# Altium schematic sheet VideoArcade.SCHDOC: LiveDesign Evaluation - Video Games
size A3; Organization: Altium Limited; Address1: L3, 12a Rodborough Rd; Address2: Frenchs Forest; Address3: NSW; Address4: Australia 2086; DocumentNumber: 1; SheetNumber: 1; SheetTotal: 13
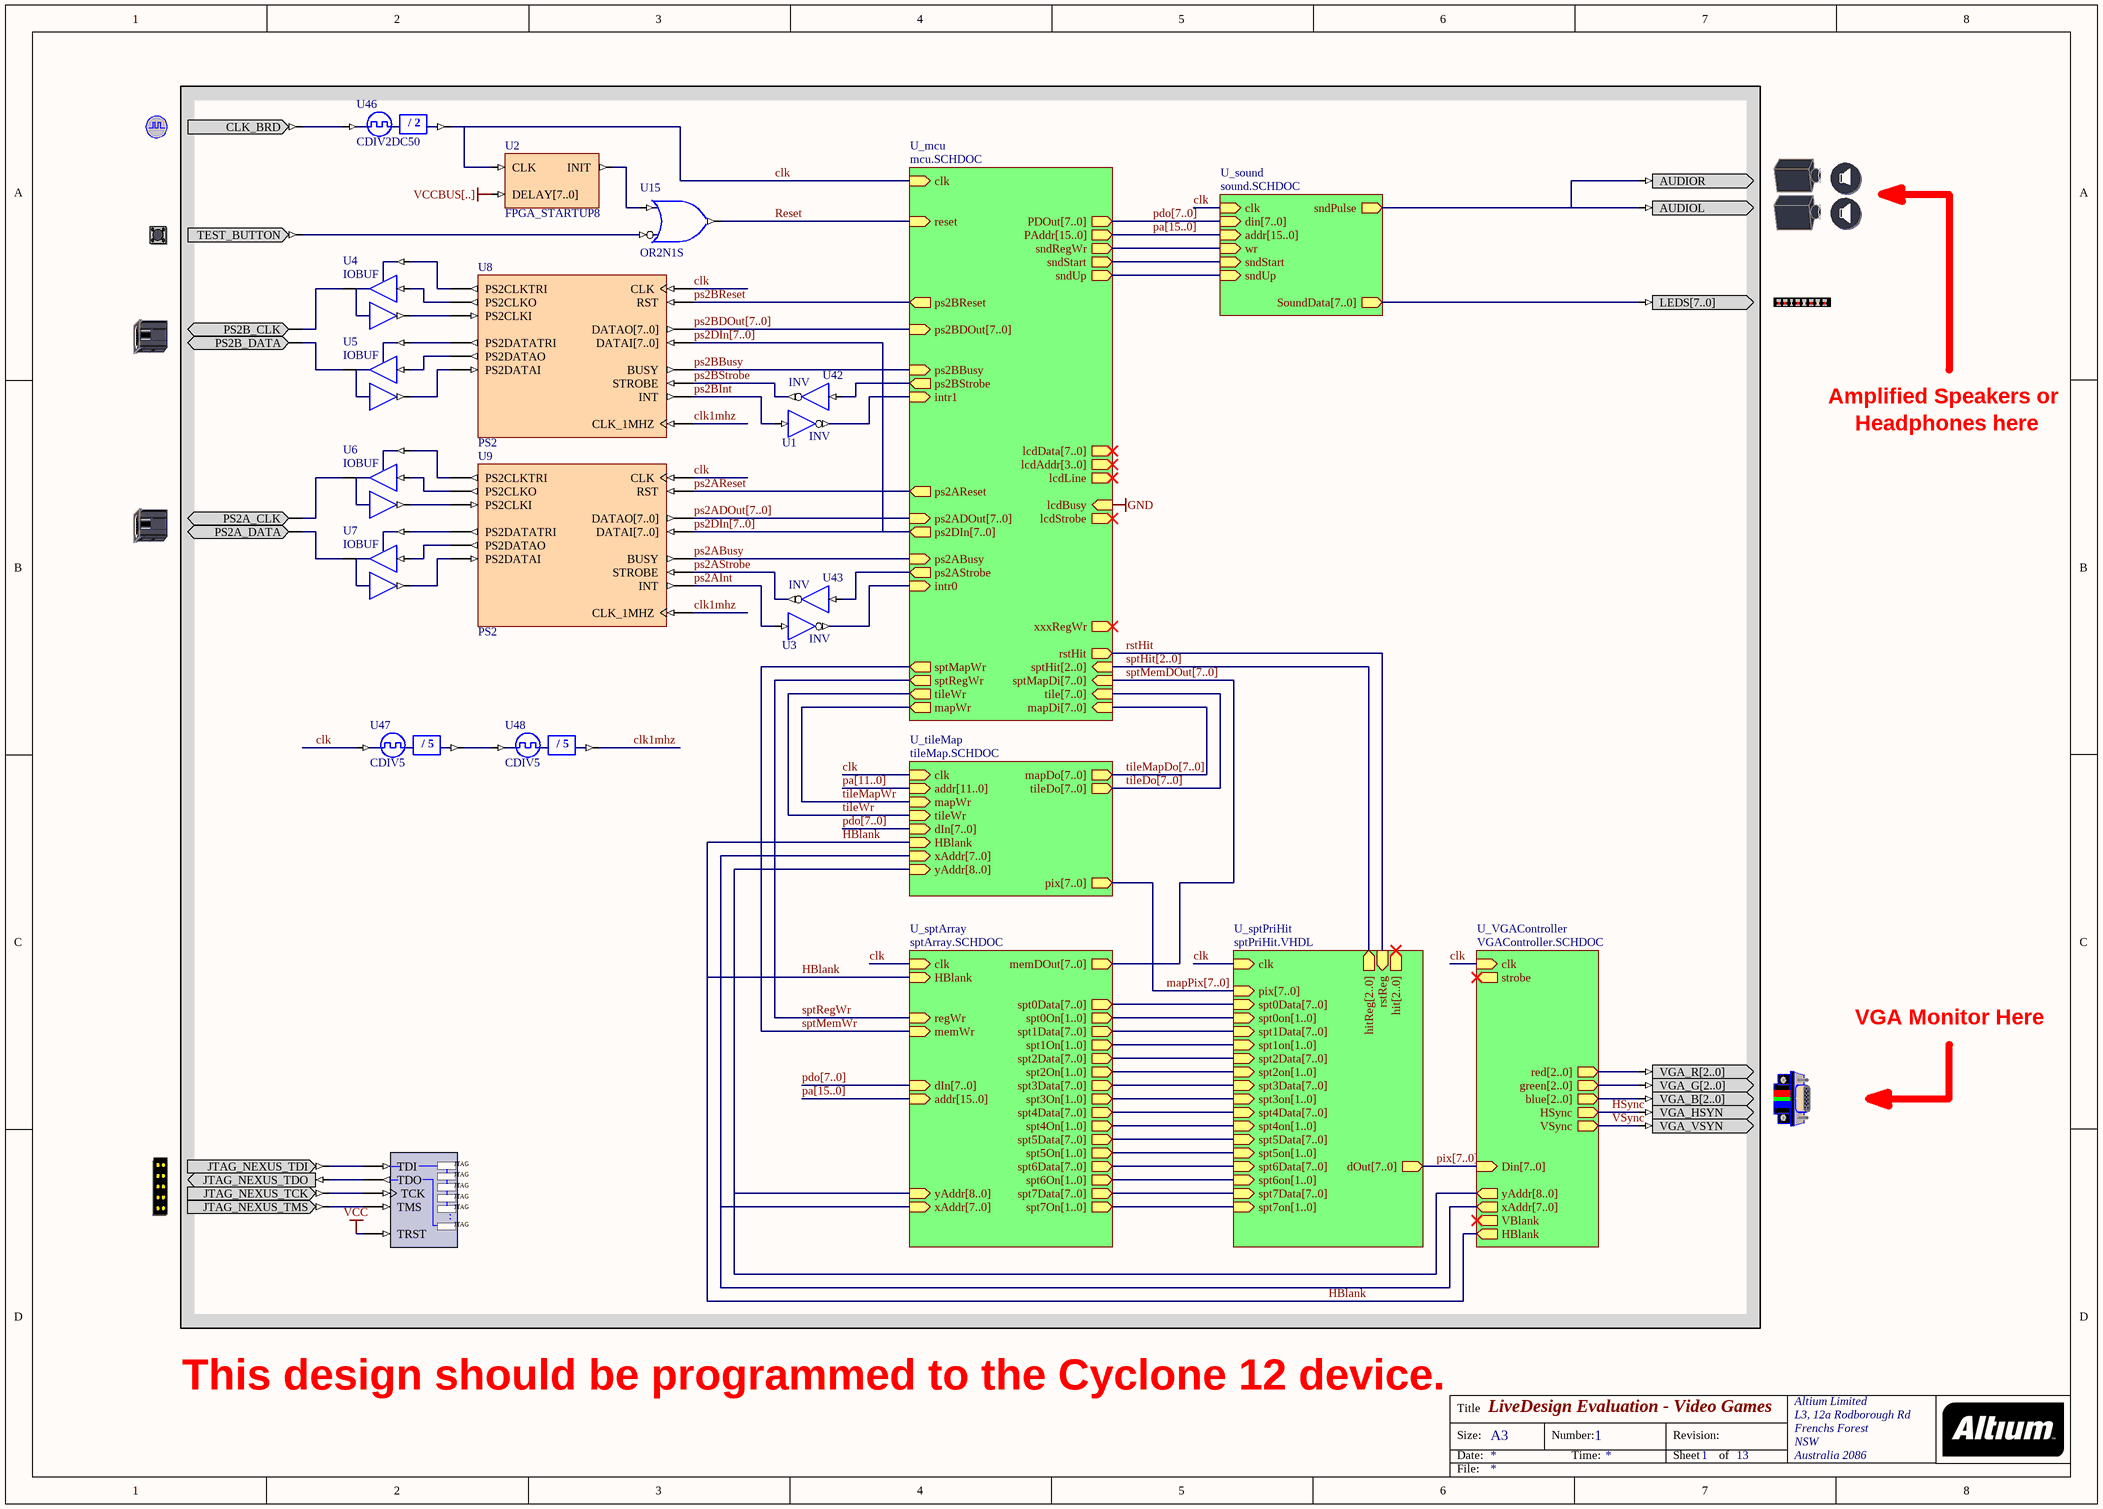
[diagram p0: VideoArcade.SCHDOC]

## Parts
?  LED  (value not drawn)
CLOCK_BOARD  CLOCK_BOARD  (value not drawn)
NEXUS_JTAG_CONNECTOR  NEXUS_JTAG_CONNECTOR  (value not drawn)
NEXUS_JTAG_PORT  NEXUS_JTAG_PORT  (value not drawn)
PS2A  PS2A  (value not drawn)
PS2B  PS2B  (value not drawn)
STEREO  STEREO  (value not drawn)
TEST_BUTTON  TEST_BUTTON  (value not drawn)
U1  INV
U2  FPGA_STARTUP8
U3  INV
U4  IOBUF
U5  IOBUF
U6  IOBUF
U7  IOBUF
U8  PS2
U9  PS2
U15  OR2N1S
U42  INV
U43  INV
U46  CDIV2DC50
U47  CDIV5
U48  CDIV5
VGACNTR  VGACNTR  (value not drawn)

## Sub-sheets
U_mcu = mcu.SCHDOC: reset (in), clk (in), intr0 (in), intr1 (in), sptMapDi[7..0] (in), mapDi[7..0] (in), tile[7..0] (in), sptMapWr (out), mapWr (out), tileWr (out), rstHit (out), lcdData[7..0] (out), sptHit[2..0] (in), ps2DIn[7..0] (out), ps2ADOut[7..0] (in), lcdAddr[3..0] (out), ps2BDOut[7..0] (in), PAddr[15..0] (out), PDOut[7..0] (out), sptRegWr (out), sndRegWr (out), xxxRegWr (out), ps2BStrobe (out), sndUp (out), ps2AStrobe (out), ps2AReset (out), sndStart (out), ps2BReset (out), lcdBusy (in), ps2ABusy (in), ps2BBusy (in), lcdStrobe (out), lcdLine (out)
U_sound = sound.SCHDOC: wr (in), addr[15..0] (in), din[7..0] (in), clk (in), sndStart (in), sndPulse (out), sndUp (in), SoundData[7..0] (out)
U_sptArray = sptArray.SCHDOC: HBlank (in), yAddr[8..0] (in), xAddr[7..0] (in), spt0Data[7..0] (out), spt0On[1..0] (out), spt1Data[7..0] (out), spt1On[1..0] (out), spt2Data[7..0] (out), spt2On[1..0] (out), spt3Data[7..0] (out), spt3On[1..0] (out), spt4Data[7..0] (out), spt4On[1..0] (out), spt5Data[7..0] (out), spt5On[1..0] (out), spt6Data[7..0] (out), spt6On[1..0] (out), spt7Data[7..0] (out), spt7On[1..0] (out), clk (in), dIn[7..0] (in), regWr (in), addr[15..0] (in), memWr (in), memDOut[7..0] (out)
U_sptPriHit = sptPriHit.VHDL: clk (in), dOut[7..0] (out), hit[2..0] (out), hitReg[2..0] (out), pix[7..0] (in), rstReg (in), spt0Data[7..0] (in), spt0on[1..0] (in), spt1Data[7..0] (in), spt1on[1..0] (in), spt2Data[7..0] (in), spt2on[1..0] (in), spt3Data[7..0] (in), spt3on[1..0] (in), spt4Data[7..0] (in), spt4on[1..0] (in), spt5Data[7..0] (in), spt5on[1..0] (in), spt6Data[7..0] (in), spt6on[1..0] (in), spt7Data[7..0] (in), spt7on[1..0] (in)  | VHDLENTITY: sptPriHit
U_tileMap = tileMap.SCHDOC: clk (in), addr[11..0] (in), mapWr (in), tileWr (in), dIn[7..0] (in), HBlank (in), pix[7..0] (out), xAddr[7..0] (in), yAddr[8..0] (in), tileDo[7..0] (out), mapDo[7..0] (out)
U_VGAController = VGAController.SCHDOC: green[2..0] (out), red[2..0] (out), blue[2..0] (out), HSync (out), VSync (out), clk (in), strobe (out), Din[7..0] (in), xAddr[7..0] (out), yAddr[8..0] (out), VBlank (out), HBlank (out)

## Nets
GND: sheet U_mcu/lcdBusy
VCC: NEXUS_JTAG_PORT.TRST
VCCBUS[..]: U2.DELAY[7..0]
clk: U2.CLK U8.CLK U9.CLK U46.CLKDV U47.CLKIN ; sheet U_sptArray/clk, sheet U_sptPriHit/clk, sheet U_VGAController/clk, sheet U_tileMap/clk, sheet U_mcu/clk, sheet U_sound/clk
clk1mhz: U8.CLK_1MHZ U9.CLK_1MHZ U48.CLKDV
HBlank: sheet U_sptArray/HBlank, sheet U_VGAController/HBlank, sheet U_tileMap/HBlank
HSync: VGACNTR.VGA_HSYN ; sheet U_VGAController/HSync
ps2ABusy: U9.BUSY ; sheet U_mcu/ps2ABusy
ps2ADOut[7..0]: U9.DATAO[7..0] ; sheet U_mcu/ps2ADOut[7..0]
ps2AInt: U3.I U9.INT
ps2AReset: U9.RST ; sheet U_mcu/ps2AReset
ps2AStrobe: U9.STROBE U43.O
ps2BBusy: U8.BUSY ; sheet U_mcu/ps2BBusy
ps2BDOut[7..0]: U8.DATAO[7..0] ; sheet U_mcu/ps2BDOut[7..0]
ps2BInt: U1.I U8.INT
ps2BReset: U8.RST ; sheet U_mcu/ps2BReset
ps2BStrobe: U8.STROBE U42.O
ps2DIn[7..0]: U8.DATAI[7..0] U9.DATAI[7..0] ; sheet U_mcu/ps2DIn[7..0]
Reset: U15.O ; sheet U_mcu/reset
rstHit: sheet U_sptPriHit/rstReg, sheet U_mcu/rstHit
sptMemWr: sheet U_sptArray/memWr, sheet U_mcu/sptMapWr
sptRegWr: sheet U_sptArray/regWr, sheet U_mcu/sptRegWr
tileMapWr: sheet U_tileMap/mapWr, sheet U_mcu/mapWr
tileWr: sheet U_tileMap/tileWr, sheet U_mcu/tileWr
VSync: VGACNTR.VGA_VSYN ; sheet U_VGAController/VSync
Net?_LEDS[7..0]: ?.LEDS[7..0] ; sheet U_sound/SoundData[7..0]
NetCLOCK_BOARD_CLK_BRD: CLOCK_BOARD.CLK_BRD U46.CLKIN
NetNEXUS_JTAG_CONNECTOR_JTAG_NEXUS_TCK: NEXUS_JTAG_CONNECTOR.JTAG_NEXUS_TCK NEXUS_JTAG_PORT.TCK
NetNEXUS_JTAG_CONNECTOR_JTAG_NEXUS_TDI: NEXUS_JTAG_CONNECTOR.JTAG_NEXUS_TDI NEXUS_JTAG_PORT.TDI
NetNEXUS_JTAG_CONNECTOR_JTAG_NEXUS_TDO: NEXUS_JTAG_CONNECTOR.JTAG_NEXUS_TDO NEXUS_JTAG_PORT.TDO
NetNEXUS_JTAG_CONNECTOR_JTAG_NEXUS_TMS: NEXUS_JTAG_CONNECTOR.JTAG_NEXUS_TMS NEXUS_JTAG_PORT.TMS
NetPS2A_PS2A_CLK: PS2A.PS2A_CLK U6.IO
NetPS2A_PS2A_DATA: PS2A.PS2A_DATA U7.IO
NetPS2B_PS2B_CLK: PS2B.PS2B_CLK U4.IO
NetPS2B_PS2B_DATA: PS2B.PS2B_DATA U5.IO
NetSTEREO_AUDIOL: STEREO.AUDIOL STEREO.AUDIOR ; sheet U_sound/sndPulse
NetTEST_BUTTON_TEST_BUTTON: TEST_BUTTON.TEST_BUTTON U15.I0
NetU1_O: U1.O ; sheet U_mcu/intr1
NetU2_INIT: U2.INIT U15.I1
NetU3_O: U3.O ; sheet U_mcu/intr0
NetU4_I: U4.I U8.PS2CLKO
NetU4_O: U4.O U8.PS2CLKI
NetU4_T: U4.T U8.PS2CLKTRI
NetU5_I: U5.I U8.PS2DATAO
NetU5_O: U5.O U8.PS2DATAI
NetU5_T: U5.T U8.PS2DATATRI
NetU6_I: U6.I U9.PS2CLKO
NetU6_O: U6.O U9.PS2CLKI
NetU6_T: U6.T U9.PS2CLKTRI
NetU7_I: U7.I U9.PS2DATAO
NetU7_O: U7.O U9.PS2DATAI
NetU7_T: U7.T U9.PS2DATATRI
NetU42_I: U42.I ; sheet U_mcu/ps2BStrobe
NetU43_I: U43.I ; sheet U_mcu/ps2AStrobe
NetU47_CLKDV: U47.CLKDV U48.CLKIN
NetVGACNTR_VGA_B[2..0]: VGACNTR.VGA_B[2..0] ; sheet U_VGAController/blue[2..0]
NetVGACNTR_VGA_G[2..0]: VGACNTR.VGA_G[2..0] ; sheet U_VGAController/green[2..0]
NetVGACNTR_VGA_R[2..0]: VGACNTR.VGA_R[2..0] ; sheet U_VGAController/red[2..0]
(unnamed): sheet U_mcu/sndRegWr, sheet U_sound/wr
(unnamed): sheet U_mcu/sndUp, sheet U_sound/sndUp
(unnamed): sheet U_mcu/sndStart, sheet U_sound/sndStart

## Buses and harness runs
bus mapPix[7..0] = sheet U_sptPriHit/pix[7..0] = sheet U_tileMap/pix[7..0]
bus pa[11..0] = sheet U_tileMap/addr[11..0]
bus pa[15..0] = sheet U_mcu/PAddr[15..0] = sheet U_sound/addr[15..0]
bus pa[15..0] = sheet U_sptArray/addr[15..0]
bus pdo[7..0] = sheet U_mcu/PDOut[7..0] = sheet U_sound/din[7..0]
bus pdo[7..0] = sheet U_sptArray/dIn[7..0]
bus pdo[7..0] = sheet U_tileMap/dIn[7..0]
bus pix[7..0] = sheet U_sptPriHit/dOut[7..0] = sheet U_VGAController/Din[7..0]
bus ps2ADOut[7..0] = sheet U_mcu/ps2ADOut[7..0]
bus ps2BDOut[7..0] = sheet U_mcu/ps2BDOut[7..0]
bus ps2DIn[7..0] = sheet U_mcu/ps2DIn[7..0]
bus sheet U_sptArray/spt0Data[7..0] = sheet U_sptPriHit/spt0Data[7..0]
bus sheet U_sptArray/spt0On[1..0] = sheet U_sptPriHit/spt0on[1..0]
bus sheet U_sptArray/spt1Data[7..0] = sheet U_sptPriHit/spt1Data[7..0]
bus sheet U_sptArray/spt1On[1..0] = sheet U_sptPriHit/spt1on[1..0]
bus sheet U_sptArray/spt2Data[7..0] = sheet U_sptPriHit/spt2Data[7..0]
bus sheet U_sptArray/spt2On[1..0] = sheet U_sptPriHit/spt2on[1..0]
bus sheet U_sptArray/spt3Data[7..0] = sheet U_sptPriHit/spt3Data[7..0]
bus sheet U_sptArray/spt3On[1..0] = sheet U_sptPriHit/spt3on[1..0]
bus sheet U_sptArray/spt4Data[7..0] = sheet U_sptPriHit/spt4Data[7..0]
bus sheet U_sptArray/spt4On[1..0] = sheet U_sptPriHit/spt4on[1..0]
bus sheet U_sptArray/spt5Data[7..0] = sheet U_sptPriHit/spt5Data[7..0]
bus sheet U_sptArray/spt5On[1..0] = sheet U_sptPriHit/spt5on[1..0]
bus sheet U_sptArray/spt6Data[7..0] = sheet U_sptPriHit/spt6Data[7..0]
bus sheet U_sptArray/spt6On[1..0] = sheet U_sptPriHit/spt6on[1..0]
bus sheet U_sptArray/spt7Data[7..0] = sheet U_sptPriHit/spt7Data[7..0]
bus sheet U_sptArray/spt7On[1..0] = sheet U_sptPriHit/spt7on[1..0]
bus sheet U_sptArray/xAddr[7..0] = sheet U_tileMap/xAddr[7..0] = sheet U_VGAController/xAddr[7..0]
bus sheet U_sptArray/yAddr[8..0] = sheet U_tileMap/yAddr[8..0] = sheet U_VGAController/yAddr[8..0]
bus sptHit[2..0] = sheet U_mcu/sptHit[2..0] = sheet U_sptPriHit/hitReg[2..0]
bus sptMemDOut[7..0] = sheet U_mcu/sptMapDi[7..0] = sheet U_sptArray/memDOut[7..0]
bus tileDo[7..0] = sheet U_mcu/tile[7..0] = sheet U_tileMap/tileDo[7..0]
bus tileMapDo[7..0] = sheet U_mcu/mapDi[7..0] = sheet U_tileMap/mapDo[7..0]

## Notes on the sheet
- Amplified Speakers or
- Headphones here
- VGA Monitor Here
- This design should be programmed to the Cyclone 12 device.
- Title
- Size:
- Date:
- A3
- Number:
- Time:
- Revision:
- Sheet
- of
- File:
- (in symbol CDIV2DC50) / 2
- (in symbol CDIV5) / 5
- (in symbol NEXUS_JTAG_PORT) JTAG; .

## Library data of the parts
? = LED: 8-Way LEDS; PortComponent: True; Published: 19-Nov-2003; Publisher: Altium Limited
CLOCK_BOARD = CLOCK_BOARD: Global System Clock Supply; PortComponent: True; Published: 19-Nov-2003; Publisher: Altium Limited
NEXUS_JTAG_CONNECTOR = NEXUS_JTAG_CONNECTOR: JTAG Port; PortComponent: True; Published: 19-Nov-2003; Publisher: Altium Limited
NEXUS_JTAG_PORT = NEXUS_JTAG_PORT: Soft Nexus-Chain Connector; NEXUS_JTAG_CONNECTOR: True; Published: 18-Dec-2003; Publisher: Altium Limited
PS2A = PS2A: Mouse PS2 Connector; PortComponent: True; Published: 19-Nov-2003; Publisher: Altium Limited
PS2B = PS2B: Key Board PS2 Connector; PortComponent: True; Published: 19-Nov-2003; Publisher: Altium Limited
STEREO = STEREO: Sound interface; PortComponent: True; Published: 19-Nov-2003; Publisher: Altium Limited
TEST_BUTTON = TEST_BUTTON: Test Button; PortComponent: True; Published: 19-Nov-2003; Publisher: Altium Limited
U1 U3 = INV: Inverter; ArchiveName: GENERIC; Published: 7-Nov-2003; Publisher: Altium Limited; Xilinx Equivalent: INV; Core Revision: 1.00.00
U2 = FPGA_STARTUP8: FPGA Startup With 8 Bit Delay; Published: 21/01/2004; Publisher: Altium Hobart Technology Centre; Core Revision: 1.00.00
U4-U7 = IOBUF: Input/Output Buffer; ArchiveName: GENERIC; Published: 18-Sep-2003; Publisher: Altium Limited; Class I: Buffer; Xilinx Equivalent: IOBUF
U8 U9 = PS2: PS2 Controller; Published: 3/02/2004; Publisher: Altium Hobart Technology Centre; Core Revision: 1.00.00
U15 = OR2N1S: 2-Input OR Gate with Active Low A Input, Single Pin Version; Xilinx Equivalent: OR2B1; ArchiveName: GENERIC; Published: 18-Dec-2003; Publisher: Altium Limited; Core Revision: 1.00.00
U42 U43 = INV: Inverter; ArchiveName: GENERIC; VHDLIB_SIM: GENERIC_LIB; Published: 29-Jan-2004; Publisher: Altium Limited; Xilinx Equivalent: INV; Core Revision: 1.00.00
U46 = CDIV2DC50: Clock Divider by 2 with 50% Duty Cycle Output; Xilinx Equivalent: CLK_DIV2; ArchiveName: GENERIC; VHDLIB_SIM: GENERIC_LIB; Published: 29-Jan-2004; Publisher: Altium Limited; Core Revision: 1.00.00
U47 U48 = CDIV5: Clock Divider by 5; ArchiveName: GENERIC; VHDLIB_SIM: GENERIC_LIB; Published: 29-Jan-2004; Publisher: Altium Limited; Core Revision: 1.00.00
VGACNTR = VGACNTR: VGA Dsub-15-Female-HD; PortComponent: True; Published: 19-Nov-2003; Publisher: Altium Limited